# EAGLE design AnalogOutputModule_4ch_r3 (EAGLE 7.7.0)
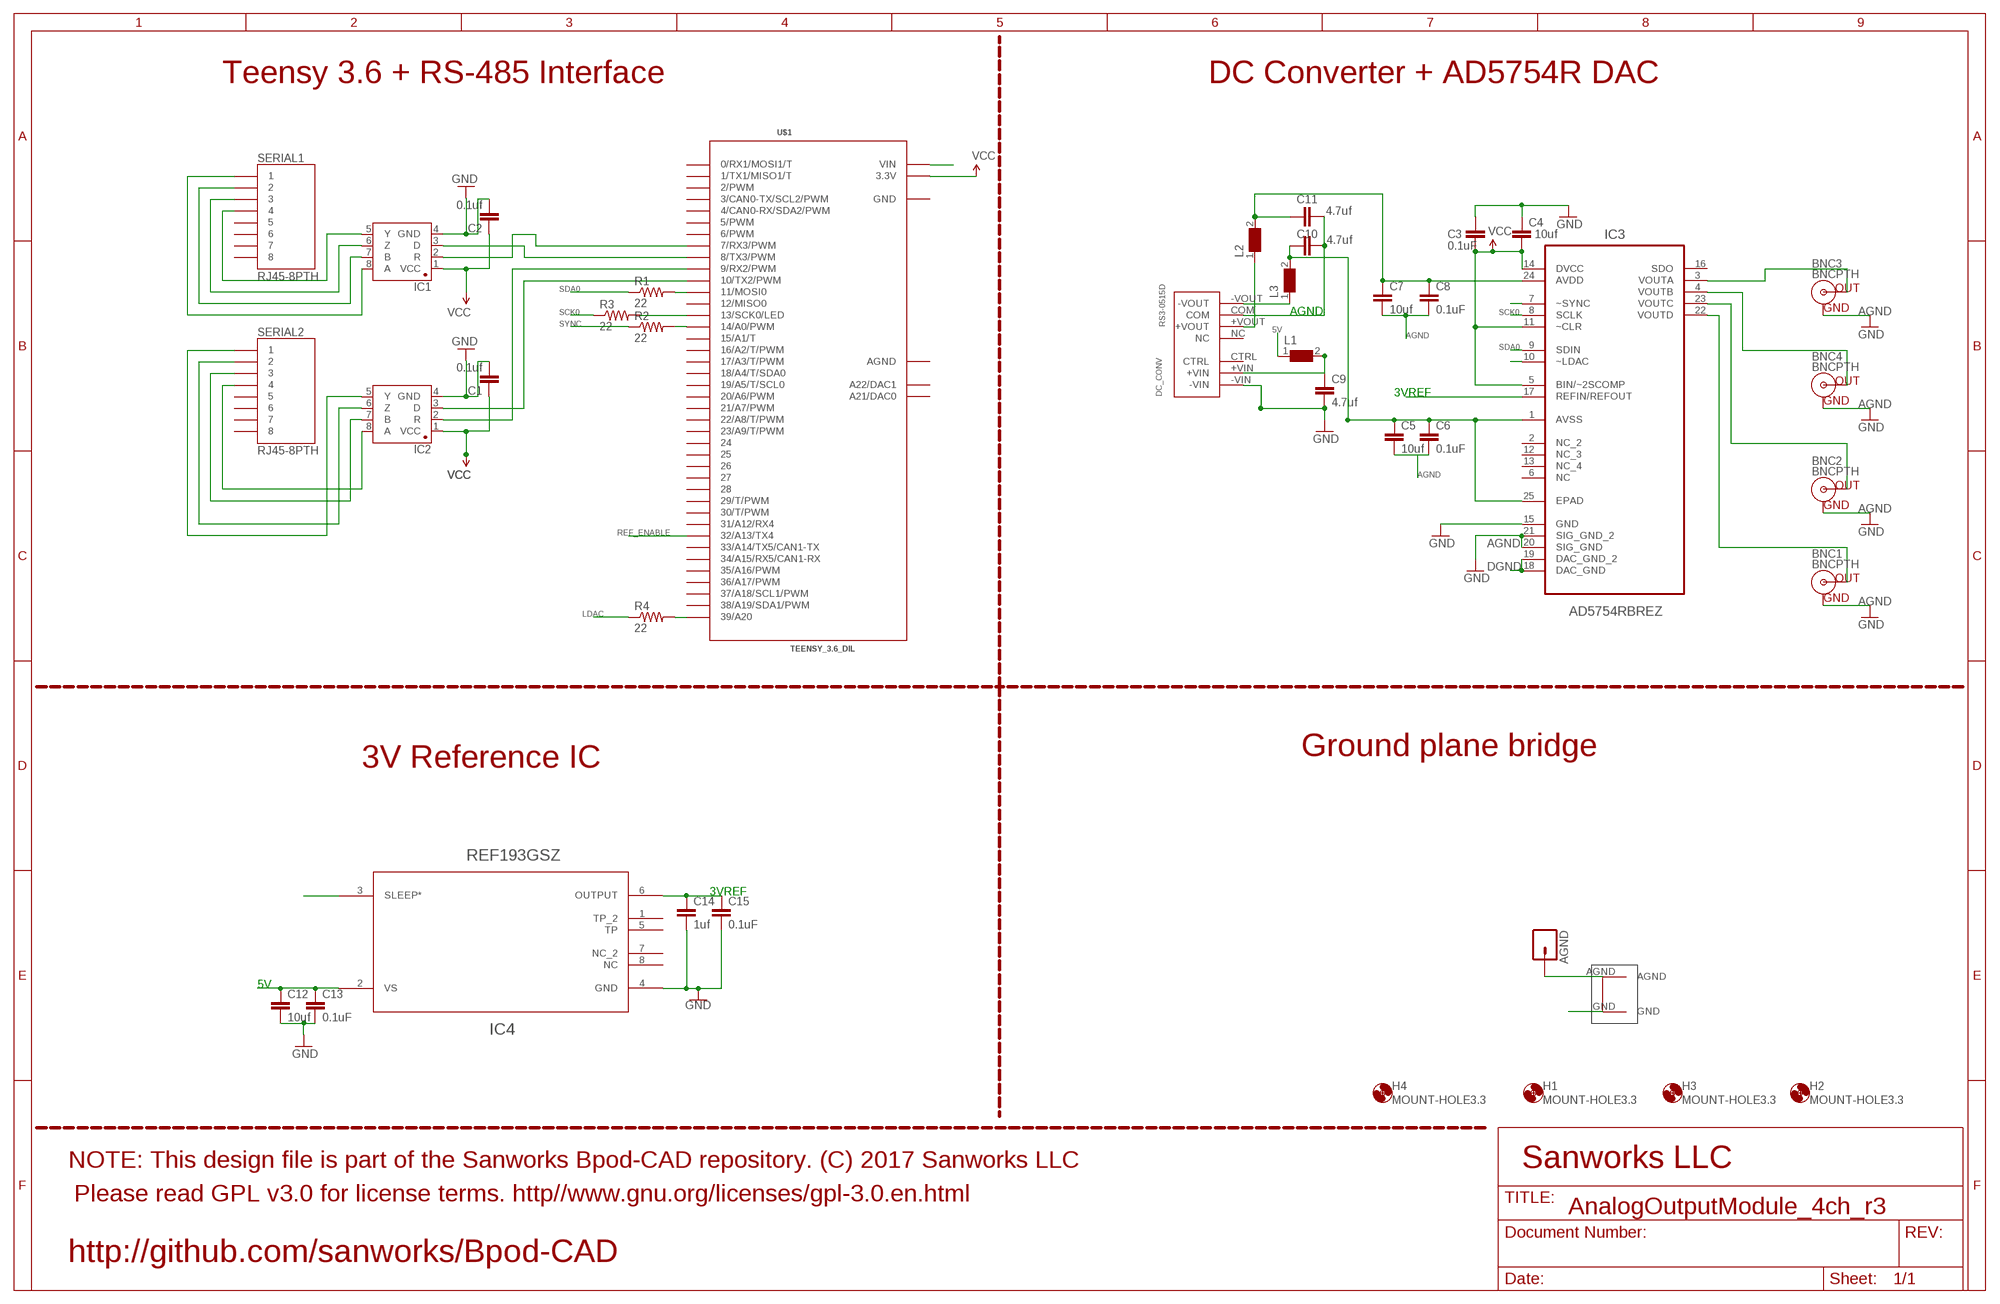
[diagram p0: schematic, sheet 1]

## Parts
AGND  M01PTH  [1X01]
BNC1  BNCPTH  [BNC]
BNC2  BNCPTH  [BNC]
BNC3  BNCPTH  [BNC]
BNC4  BNCPTH  [BNC]
C1  0.1uf  CAP1206  [1206@1]
C2  0.1uf  CAP1206  [1206@1]
C3  0.1uF  1.0UF-0805-25V-10%  [0805]
C4  10uf  CAP1206  [1206@1]
C5  10uf  CAP1206  [1206@1]
C6  0.1uF  1.0UF-0805-25V-10%  [0805]
C7  10uf  CAP1206  [1206@1]
C8  0.1uF  1.0UF-0805-25V-10%  [0805]
C9  4.7uf  CAP1206  [1206@1]
C10  4.7uf  CAP1206  [1206@1]
C11  4.7uf  CAP1206  [1206@1]
C12  10uf  CAP1206  [1206@1]
C13  0.1uF  1.0UF-0805-25V-10%  [0805]
C14  1uf  CAP1206  [1206@1]
C15  0.1uF  1.0UF-0805-25V-10%  [0805]
DC_CONV  RS3-0515D  [RS3-0515D]
H1  MOUNT-HOLE3.3  [3,3]
H2  MOUNT-HOLE3.3  [3,3]
H3  MOUNT-HOLE3.3  [3,3]
H4  MOUNT-HOLE3.3  [3,3]
IC1  SN65HVD31DR  [SO08]
IC2  SN65HVD31DR  [SO08]
IC3  AD5754RBREZ  [SOP65P640X120-25N]
IC4  REF193GSZ  [R_8]
L1  WE-CBF-742792118_1206  [1206]
L2  WE-CBF-742792118_1206  [1206]
L3  WE-CBF-742792118_1206  [1206]
R1  22  RESISTOR1206  [1206]
R2  22  RESISTOR1206  [1206]
R3  22  RESISTOR1206  [1206]
R4  22  RESISTOR1206  [1206]
SERIAL1  RJ45-8PTH  [RJ45-8]
SERIAL2  RJ45-8PTH  [RJ45-8]
U$1  TEENSY_3.6_DIL  [TEENSY_3.6_DIL]
U$6  GNDPLANESHRT  [GNDPLANESHRT]

## Nets
3VREF: C14.1 C15.1 IC3.17(REFIN/REFOUT) IC4.6(OUTPUT)
5V: C3.2 C4.2 C12.1 C13.1 IC3.5(BIN/~2SCOMP) IC3.11(~CLR) IC3.14(DVCC) IC4.2(VS) L1.1 U$1.VIN ; supply symbol labelled VCC
AGND: AGND.1 BNC1.GND BNC2.GND BNC3.GND BNC4.GND C5.2 C6.2 C7.2 C8.2 C10.1 C11.2 DC_CONV.COM IC3.18(DAC_GND) IC3.19(DAC_GND_2) IC3.20(SIG_GND) IC3.21(SIG_GND_2) U$6.AGND ; supply symbol labelled GND
GND: C1.2 C2.2 C3.1 C4.1 C9.2 C12.2 C13.2 C14.2 C15.2 DC_CONV.-VIN IC1.4(GND) IC2.4(GND) IC3.15(GND) IC4.4(GND) U$6.GND
LDAC: IC3.10(~LDAC) R4.1
N$1: IC1.3(D) U$1.8(8/TX3/PWM)
N$2: IC1.2(R) U$1.7(7/RX3/PWM)
N$3: IC2.8(A) SERIAL2.4
N$4: IC2.7(B) SERIAL2.3
N$5: IC2.6(Z) SERIAL2.2
N$6: IC2.5(Y) SERIAL2.1
N$7: IC2.3(D) U$1.10(10/TX2/PWM)
N$8: IC2.2(R) U$1.9(9/RX2/PWM)
N$9: BNC3.S(OUT) IC3.3(VOUTA)
N$10: BNC4.S(OUT) IC3.4(VOUTB)
N$11: BNC2.S(OUT) IC3.23(VOUTC)
N$12: BNC1.S(OUT) IC3.22(VOUTD)
N$13: R1.2 U$1.11(11/MOSI0)
N$14: R3.2 U$1.13(13/SCK0/LED)
N$15: DC_CONV.-VOUT L3.1
N$16: DC_CONV.+VOUT L2.1
N$17: R2.2 U$1.14/A0(14/A0/PWM)
N$18: R4.2 U$1.39/A20
N$19: IC1.8(A) SERIAL1.1
N$21: IC1.7(B) SERIAL1.2
N$22: IC1.6(Z) SERIAL1.3
N$23: IC1.5(Y) SERIAL1.4
N$39: C7.1 C8.1 C10.2 IC3.24(AVDD) L2.2
N$41: C9.1 DC_CONV.+VIN L1.2
REF_ENABLE: IC4.3(SLEEP*) U$1.32/A13(32/A13/TX4)
SCK0: IC3.8(SCLK) R3.1
SDA0: IC3.9(SDIN) R1.1
SYNC: IC3.7(~SYNC) R2.1
VCC: C1.1 C2.1 IC1.1(VCC) IC2.1(VCC) U$1.3.3V U$1.3.3V3(3.3V)
VSS: C5.1 C6.1 C11.1 IC3.1(AVSS) IC3.25(EPAD) L3.2
Unconnected: DC_CONV.CTRL DC_CONV.NC IC3.2(NC_2) IC3.6(NC) IC3.12(NC_3) IC3.13(NC_4) IC3.16(SDO) IC4.1(TP_2) IC4.5(TP) IC4.7(NC_2) IC4.8(NC) SERIAL1.5 SERIAL1.6 SERIAL1.7 SERIAL1.8 SERIAL2.5 SERIAL2.6 SERIAL2.7 SERIAL2.8 U$1.0(0/RX1/MOSI1/T) U$1.1(1/TX1/MISO1/T) U$1.2(2/PWM) U$1.3(3/CAN0-TX/SCL2/PWM) U$1.4(4/CAN0-RX/SDA2/PWM) U$1.5(5/PWM) U$1.6(6/PWM) U$1.12(12/MISO0) U$1.15/A1(15/A1/T) U$1.16/A2(16/A2/T/PWM) U$1.17/A3(17/A3/T/PWM) U$1.18/A4(18/A4/T/SDA0) U$1.19/A5(19/A5/T/SCL0) U$1.20/A6(20/A6/PWM) U$1.21/A7(21/A7/PWM) U$1.22/A8(22/A8/T/PWM) U$1.23/A9(23/A9/T/PWM) U$1.24 U$1.25 U$1.26 U$1.27 U$1.28 U$1.29(29/T/PWM) U$1.30(30/T/PWM) U$1.31/A12(31/A12/RX4) U$1.33/A14(33/A14/TX5/CAN1-TX) U$1.34/A15(34/A15/RX5/CAN1-RX) U$1.35/A16(35/A16/PWM) U$1.36/A17(36/A17/PWM) U$1.37/A18(37/A18/SCL1/PWM) U$1.38/A19(38/A19/SDA1/PWM) U$1.A21(A21/DAC0) U$1.A22(A22/DAC1)

## Notes on the sheet
- Teensy 3.6 + RS-485 Interface | DC Converter + AD5754R DAC
- SDA0
- SCK0 | AGND | SCK0 | AGND
- SYNC
- 5V
- AGND
- SDA0
- 3VREF
- AGND
- AGND
- AGND
- REF_ENABLE
- AGND
- DGND
- AGND
- LDAC
- Ground plane bridge
- 3V Reference IC
- 3VREF
- 5V
- NOTE: This design file is part of the Sanworks Bpod-CAD repository. (C) 2017 Sanworks LLC | Sanworks LLC
- Please read GPL v3.0 for license terms. http//www.gnu.org/licenses/gpl-3.0.en.html
- http://github.com/sanworks/Bpod-CAD

## Power pins joined to a net without a drawn wire
AGND: U$1.AGND
GND: U$1.GND U$1.GND1(GND)

## Library data of the parts
AGND = SparkFun-Connectors:M01: Header 1 Standard 1-pin 0.1" header. Use with straight break away headers (SKU : PRT-00116), right angle break away headers (PRT-00553), swiss pins (PRT-00743), machine pins (PRT-00117), and female headers (PRT-00115).
BNC1-BNC4 = SparkFun-Connectors:BNC: BNC Right Angle Connector Mouser Part# 5227161 SparkFun Products: BNC Connector - Right Angle <https://www.sparkfun.com/products/10550>; PROD_ID: LPA-12729; SF_ID: PRT-10550
C1 C2 C4 C5 C7 C9-C12 C14 = SparkFun-Capacitors:CAP: Capacitor Standard 0603 ceramic capacitor, and 0.1" leaded capacitor.
C3 C6 C8 C13 C15 = SparkFun-Capacitors:1.0UF: 1µF ceramic capacitors A capacitor is a passive two-terminal electrical component used to store electrical energy temporarily in an electric field.; PROD_ID: CAP-08064; VALUE: 1.0uF
DC_CONV = JoshParts10:RS3-0515D
H1-H4 = holes:MOUNT-HOLE: MOUNTING HOLE with drill center marker
IC1 IC2 = Joshparts4:SN65HVD31DR: A placeholder for generic narrow & wide SOIC8 foorptints - used on the DIP adapter board.
IC3 = Analog Devices_By_element14_Batch_1:AD5754RBREZ: DAC; MPN: AD5754RBREZ; OC_FARNELL: 1786050; OC_NEWARK: 51P3755; PACKAGE: TSSOP-24; SUPPLIER: Analog Devices
IC4 = REF193:REF193GSZ; MANUFACTURER_PART_NUMBER: REF193GSZ; VENDOR: Vendor
L1-L3 = WE-CBF:WE-CBF: SMD EMI Suppression Ferrite Beads WE-CBF - Excellent anti-EMI properties - Low DC-restistance - Impedances till 3000 ohms - Rated current up to 6 A -- Reliable Ni-Sn electrodes -- Perfect as data lined filter and for uncoupling of distribution voltage; MPN: 742792118; OC_FARNELL: 1800374; OC_NEWARK: 78R5648; PACKAGE: IND-1206; SUPPLIER: Wuerth Elektronik
R1-R4 = SparkFun-Resistors:RESISTOR: Resistor Basic schematic elements and footprints for 0603, 1206, and PTH resistors.
SERIAL1 SERIAL2 = SparkFun:RJ45-8: RJ45 Jack Simple RJ45, 8-pin connection - connector for common Cat5, Cat5e, and Cat6 Ethernet cables. Footprint not yet proven in production. Connector sku is PRT-00643; Breakout PCB sku is BOB-00716.
U$1 = Teensy_3_and_LC_Series_Boards_v1.4:TEENSY_3.6_DIL: Teensy 3.6 DIL Package
U$6 = Joshparts2:GNDPLANESHRT

## Net classes
0 default: width 0.203 mm

## Board
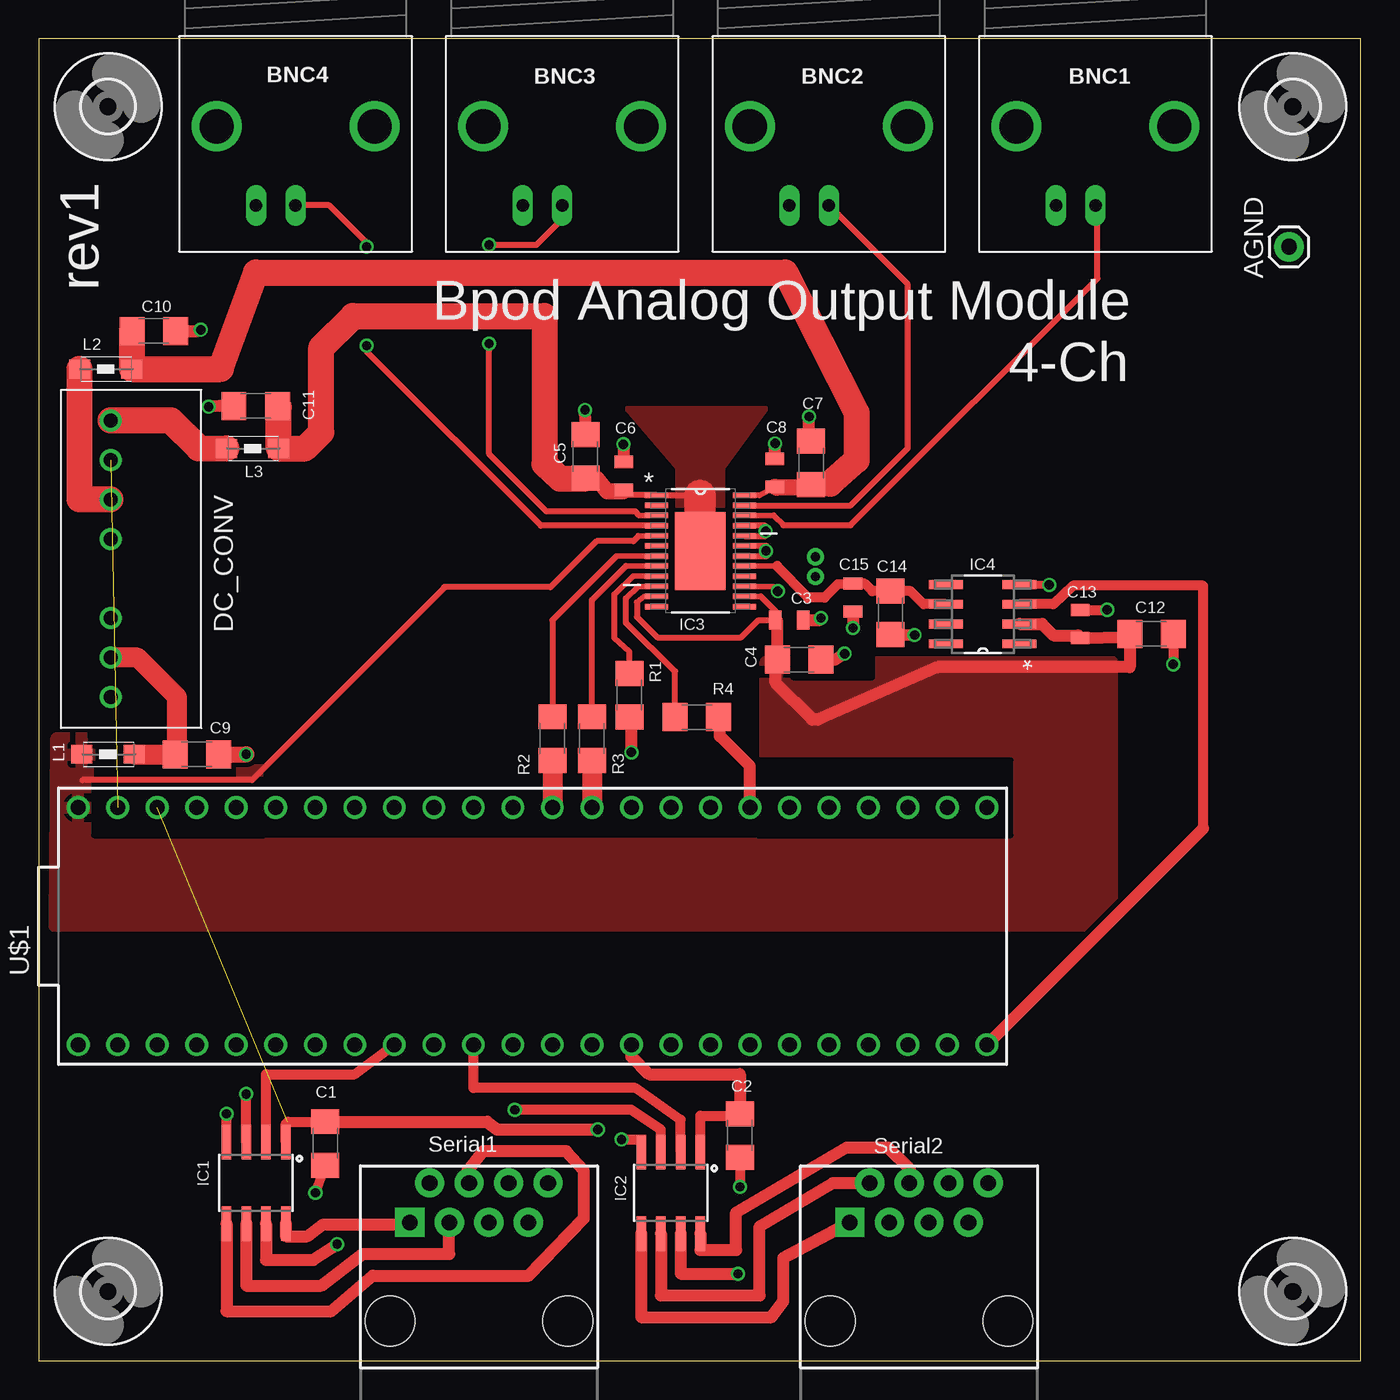
[diagram p1: board, top side]
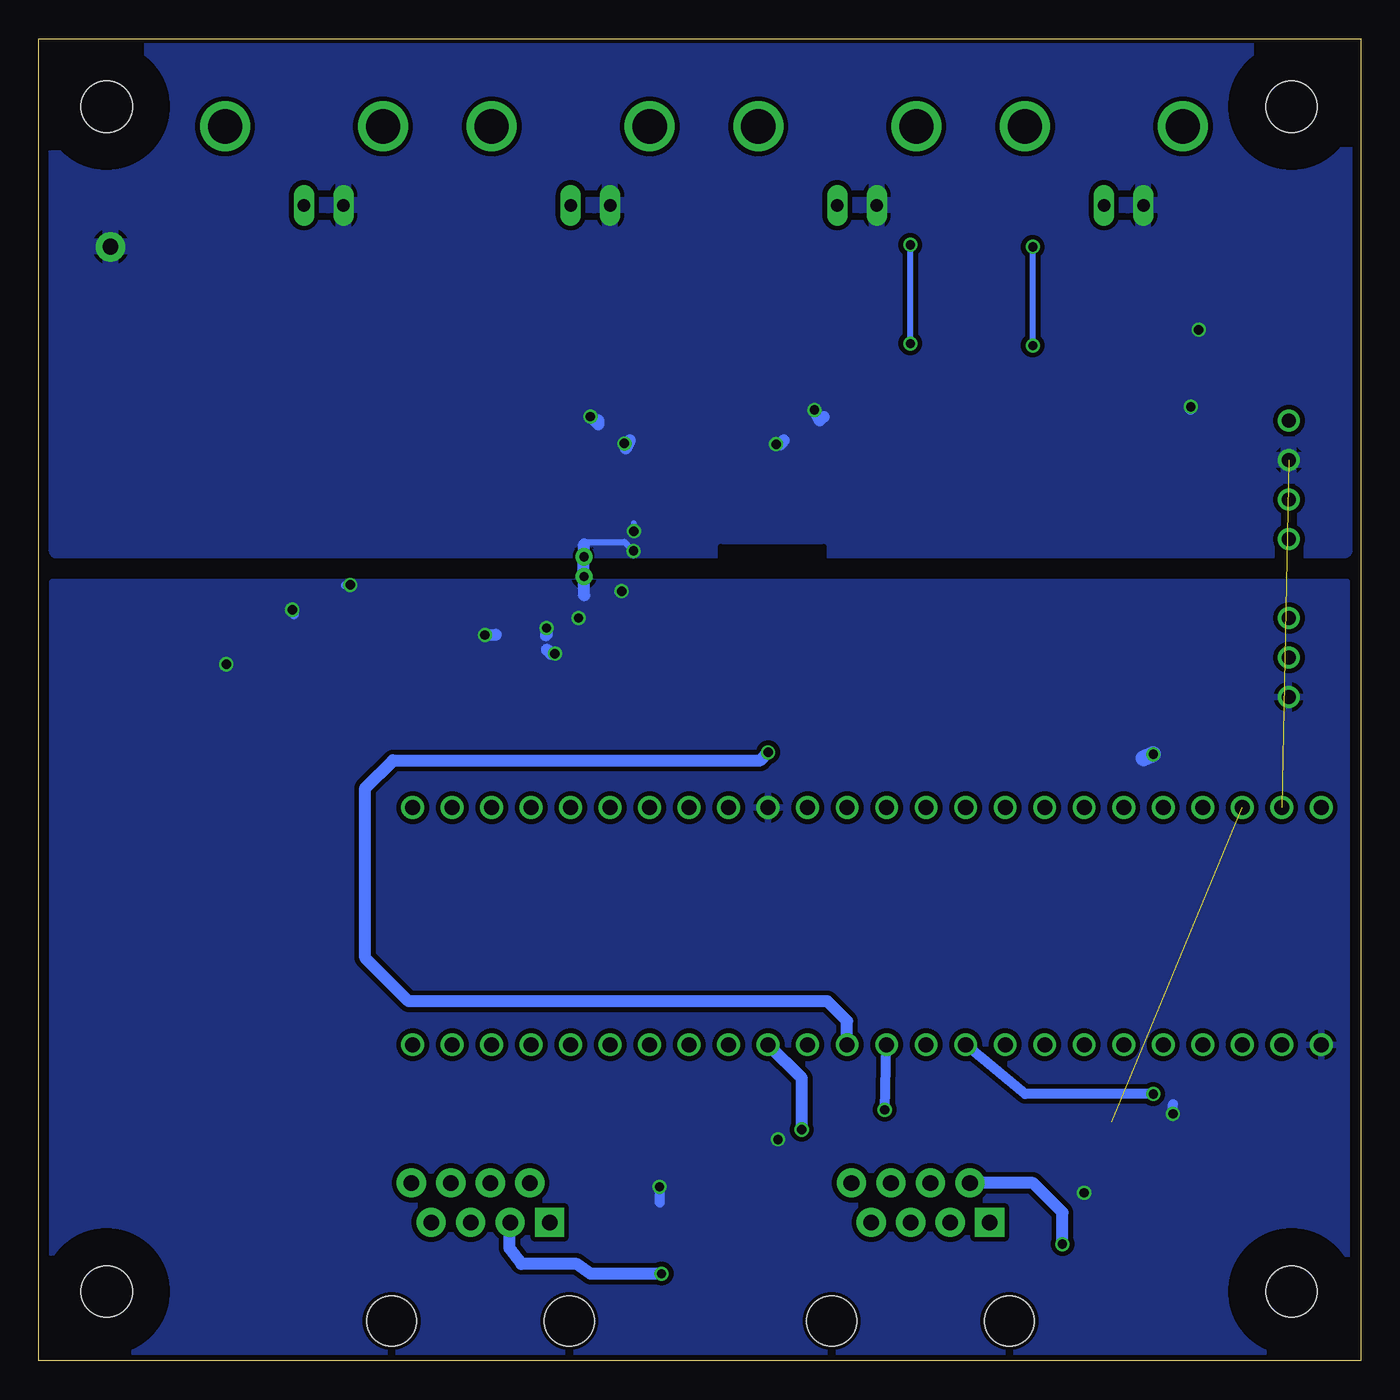
[diagram p2: board, bottom side, seen from below]

Size 85 x 85 mm. Coordinates in mm from the lower left corner, seen from the top.
Outline: 0,0 85,0 85,85 0,85 0,0
Copper layers (1*16): Top 0.035mm / dielectric 1.5mm / Bottom 0.035mm
Design rules "SeeedStudio_2layer_DRU_no_angle_20140221 *": minimum track width 6mil, minimum drill 12mil, track to track 12mil, track to pad 12mil, pad to pad 12mil, via to via 12mil, smd to smd 0mil, copper to edge 10mil, drill to drill 10mil, minimum pad ring 10mil, minimum via ring 6mil, stop-mask expansion 2mil, vias tented up to drill 100mil, thermal gap 10mil
tRestrict: area 46.2,33.8 to 62.5,38.6; area 3.8,37.6 to 11.4,40.6; area 3.6,33.8 to 14.5,37.3; area 48.5,43.9 to 53.6,46
bRestrict: area 34.5,50.8 to 41.1,52.3

### Footprints (pad centres in the part's own frame; a part is rotated, then mirrored left to right if it is on the bottom)
1X01 = drill 1.016 pad 1.88: 1 0,0
BNC = drill 2.2: 3 -5.08,5.08; 4 5.08,5.08 | drill 0.8 long: GND -2.54,0; S 0,0
1206@1 = smd 1.6 x 1.8: 1 -1.4,0; 2 1.4,0
0805 = smd 0.8 x 1.2: 1 -0.9,0; 2 0.9,0
RS3-0515D = drill 0.9: +VIN 7.62,5.08; +VOUT 17.78,5.08; -VIN 5.08,5.08; -VOUT 22.86,5.08; COM 20.32,5.08; CTRL 10.16,5.08; NC 15.24,5.08
3,3 = hole 3.3: 0,0
SO08 = smd 0.61 x 2.21: 1 -1.905,-2.616; 2 -0.635,-2.616; 3 0.635,-2.616; 4 1.905,-2.616; 5 1.905,2.616; 6 0.635,2.616; 7 -0.635,2.616; 8 -1.905,2.616
SOP65P640X120-25N = smd 1.473 x 0.356: 1 -2.819,3.581; 2 -2.819,2.921; 3 -2.819,2.286; 4 -2.819,1.626; 5 -2.819,0.965; 6 -2.819,0.33; 7 -2.819,-0.33; 8 -2.819,-0.965; 9 -2.819,-1.626; 10 -2.819,-2.286; 11 -2.819,-2.921; 12 -2.819,-3.581; 13 2.819,-3.581; 14 2.819,-2.921; 15 2.819,-2.286; 16 2.819,-1.626; 17 2.819,-0.965; 18 2.819,-0.33; 19 2.819,0.33; 20 2.819,0.965; 21 2.819,1.626; 22 2.819,2.286; 23 2.819,2.921; 24 2.819,3.581 | smd 3.251 x 5.029: 25 0,0
R_8 = smd 2.184 x 0.559: 1 -2.362,1.905; 2 -2.362,0.635; 3 -2.362,-0.635; 4 -2.362,-1.905; 5 2.362,-1.905; 6 2.362,-0.635; 7 2.362,0.635; 8 2.362,1.905
1206 = smd 1.35 x 1.2: 1 -1.675,0; 2 1.675,0
1206' = smd 1.6 x 1.8: 1 -1.4,0; 2 1.4,0
RJ45-8 = drill 1 pad 1.88 square: 1 -4.445,6.35 | drill 1 pad 1.88: 2 -3.175,8.89; 3 -1.905,6.35; 4 -0.635,8.89; 5 0.635,6.35; 6 1.905,8.89; 7 3.175,6.35; 8 4.445,8.89 | hole 3.2: -5.715,0; 5.715,0
TEENSY_3.6_DIL = drill 0.965: 0 -7.62,25.4; 1 -7.62,22.86; 2 -7.62,20.32; 3 -7.62,17.78; 3.3V 7.62,22.86; 3.3V3 -7.62,-7.62; 4 -7.62,15.24; 5 -7.62,12.7; 6 -7.62,10.16; 7 -7.62,7.62; 8 -7.62,5.08; 9 -7.62,2.54; 10 -7.62,0; 11 -7.62,-2.54; 12 -7.62,-5.08; 13 7.62,-5.08; 14/A0 7.62,-2.54; 15/A1 7.62,0; 16/A2 7.62,2.54; 17/A3 7.62,5.08; 18/A4 7.62,7.62; 19/A5 7.62,10.16; 20/A6 7.62,12.7; 21/A7 7.62,15.24; 22/A8 7.62,17.78; 23/A9 7.62,20.32; 24 -7.62,-10.16; 25 -7.62,-12.7; 26 -7.62,-15.24; 27 -7.62,-17.78; 28 -7.62,-20.32; 29 -7.62,-22.86; 30 -7.62,-25.4; 31/A12 -7.62,-27.94; 32/A13 -7.62,-30.48; 33/A14 7.62,-30.48; 34/A15 7.62,-27.94; 35/A16 7.62,-25.4; 36/A17 7.62,-22.86; 37/A18 7.62,-20.32; 38/A19 7.62,-17.78; 39/A20 7.62,-15.24; A21 7.62,-12.7; A22 7.62,-10.16; AGND 7.62,25.4; GND -7.62,27.94; GND1 7.62,-7.62; VIN 7.62,27.94
GNDPLANESHRT = drill 0.6: AGND -1.27,0; GND 0,0

### Placement (x,y rotation side)
AGND  80.39,71.63 0 top
BNC1  67.94,74.3 0 top
BNC2  50.8,74.3 0 top
BNC3  33.66,74.3 0 top
BNC4  16.51,74.3 0 top
C1  18.41,13.97 270 top
C2  45.09,14.48 270 top
C3  48.26,47.62 180 top
C4  48.9,45.09 180 top
C5  35.15,58.15 90 top
C6  37.62,56.91 90 top
C7  49.66,57.73 90 top
C8  47.33,57.09 90 top
C9  10.16,38.99 0 top
C10  7.4,66.22 180 top
C11  13.94,61.39 180 top
C12  71.55,46.74 0 top
C13  66.95,47.37 90 top
C14  54.76,48.08 270 top
C15  52.35,49.07 270 top
DC_CONV  9.69,37.59 90 top
H1  80.64,4.45 0 top
H2  4.45,4.45 0 top
H3  4.45,80.64 0 top
H4  80.64,80.64 0 top
IC1  13.97,11.43 180 top
IC2  40.64,10.79 180 top
IC3  42.55,52.07 0 top
IC4  60.71,48.01 180 top
L1  4.45,38.99 0 top
L2  4.29,63.77 0 top
L3  13.74,58.65 0 top
R1  22  [1206']  37.97,42.8 270 top
R2  22  [1206']  33.02,40.01 270 top
R3  22  [1206']  35.56,40.01 270 top
R4  22  [1206']  42.32,41.38 0 top
SERIAL1  28.3,2.54 0 top
SERIAL2  56.6,2.54 0 top
U$1  30.48,27.94 90 top
U$6  49.94,50.42 270 top

### Tracks (layer width: path | path; a pad name or v marks a point on that pad's centre or on a via)
3VREF
  Top 0.356: 47.47,51.1 IC3.17
  Top 0.635: IC4.6 56.9,48.64 56.06,49.48 C14.1 53.59,49.48 53.11,49.96 52.39,49.96 C15.1 51.37,49.92 50.52,49.07 49.45,49.07 47.47,51.1
5V
  Top 0.356: 46.43,49.15 IC3.14 | IC3.11 38.91,49.15 38.46,48.77 | IC3.5 38.56,53.03
  Top 0.381: 47.16,47.37 C3.2 | 46.43,49.15 47.4,48.18 47.4,47.64 C3.2 | 38.46,48.77 38.46,47.83 39.78,46.51 45.16,46.51 46.28,47.62 C3.2 | 47.47,46.51 47.49,46.53 | 2.79,37.34 13.72,37.34 26.04,49.66 26.04,49.73 32.89,49.73 35.87,52.7 38.23,52.7 38.56,53.03
  Top 0.635: 63.08,47.38 IC4.2
  Top 0.762: C3.2 47.49,47.54 47.49,46.53 C4.2 47.37,44.96 47.37,43.59 49.73,41.22 50.09,41.22 57.78,44.6 70.16,44.6 70.15,44.6 C12.1 69.94,46.52 C13.1 66.84,46.63 65.25,46.63 64.5,47.38 63.08,47.38
  pour Top: 1.12,40.03 14.07,40.03 13.97,33.27 46.74,33.27 46.74,44.96 69.01,44.93 69.01,27.91 1.02,27.94
AGND  (via drill 0.6)  (1 unrouted)
  Top 0.381: v46.74,53.34 46.74,53.03 IC3.20 46.71,53.03 46.71,53.7 IC3.21 | IC3.19 46.76,52.4 v46.76,52.07 46.76,51.74 IC3.18
  Top 0.762: C5.2 35.15,60.36 v35.13,61.14 | C6.2 37.62,58.9 v37.59,58.93 | C8.2 47.35,58.83 v47.35,58.98 | C7.2 49.53,59.05 v49.53,60.71 | C10.1 10.16,66.22 v10.41,66.29 | C11.2 11.61,61.39 v10.92,61.34
  Bottom 0.381: v46.74,53.34 46.74,53.85 | 46.79,51.77 46.79,52.07 v46.76,52.07 47.35,52.65 49.78,52.65 49.94,52.5
  Bottom 0.762: v35.13,61.14 34.8,60.45 34.54,60.71 | v37.59,58.93 37.34,58.93 37.08,59.18 | v47.35,58.98 47.24,58.67 46.99,59.18 | v49.53,60.71 49.02,60.2 49.02,60.45 | v10.92,61.34 10.92,61.21 | U$6.AGND 49.94,52.5
  pour Bottom: 1.04,84.48 1.04,52.1 83.85,52.07 83.85,84.45
GND  (via drill 0.6)
  Top 0.356: IC3.15 47.22,49.78 v47.52,49.48
  Top 0.508: IC4.4 64.95,49.91 v64.97,49.89
  Top 0.635: C1.2 v17.78,10.79 | IC1.4 v12.06,15.88 | C2.2 v45.09,11.18 | v37.47,14.22 38.73,14.22 IC2.4 | C12.2 v72.95,44.78 | C13.2 v68.71,48.28
  Top 0.762: C3.1 50.16,47.62 v50.29,47.75 | C4.1 51.18,45.09 v51.82,45.47 | C14.2 55.04,46.68 v56.31,46.66 | C15.2 v52.35,47.12
  Top 1.016: C9.2 v13.34,38.99
  Bottom 0.381: v47.52,49.48 47.8,49.48 47.83,49.45
  Bottom 0.508: v64.97,49.89 65.3,49.89 65.33,49.86
  Bottom 0.635: v12.06,15.88 12.06,16.51 | v45.09,11.18 45.09,10.16 | v72.95,44.78 72.87,44.83 | v68.71,48.28 68.61,48.01
  Bottom 0.762: v51.82,45.47 52.07,45.47 52.32,45.72 | 49.96,51.77 49.96,50.11 49.96,49.25 49.94,49.23 U$6.GND | v56.31,46.66 55.63,46.69 | v52.35,47.12 52.35,46.71 52.4,46.66
  Bottom 1.016: v13.34,38.99 13.97,38.73
  pour Bottom: 0.89,50.09 0.89,0.56 84.15,0.53 84.15,50.06
LDAC
  Top 0.356: 38.56,49.78 IC3.10
  Top 0.381: R4.1 40.92,44.33 37.74,47.45 37.74,49.02 38.56,49.78
N$1  (via drill 0.6)
  Top 0.635: IC1.3 v13.34,17.14
  Bottom 0.635: v13.34,17.14 21.59,17.14 U$1.8
N$2
  Top 0.635: IC1.2 14.61,18.41 20.32,18.41 U$1.7
N$3
  Top 0.762: SERIAL2.4 56.01,11.47 56.01,12.32 54.61,13.72 51.94,13.72 44.83,9.53 44.83,7.11 42.55,7.11 IC2.8
N$4  (via drill 0.6)
  Top 0.762: IC2.7 41.27,5.59 v44.96,5.59
  Bottom 0.762: v44.96,5.59 49.53,5.59 50.42,6.22 53.98,6.22 54.74,7.24 54.74,8.85 SERIAL2.3
N$5
  Top 0.762: IC2.6 40.01,4.19 46.35,4.19 46.35,8.64 51.05,11.43 SERIAL2.2
N$6
  Top 0.762: IC2.5 38.73,2.79 47.12,2.79 47.88,3.81 47.88,6.6 SERIAL2.1 52.07,8.8
N$7  (via drill 0.6)
  Top 0.635: IC2.3 40.01,14.86 38.1,16.13 v30.61,16.13
  Bottom 0.635: v30.61,16.13 U$1.10
N$8
  Top 0.635: IC2.2 41.27,15.49 38.35,17.53 27.94,17.53 U$1.9
N$9  (via drill 0.6)
  Top 0.356: IC3.3 38.61,54.36
  Top 0.381: v28.96,71.75 32,71.75 33.66,73.41 BNC3.S | v28.96,65.41 28.96,58.29 32.64,54.61 38.35,54.61 38.61,54.36
  Bottom 0.381: v28.96,65.41 v28.96,71.75
N$10  (via drill 0.6)
  Top 0.381: IC3.4 32.28,53.7 21.08,64.9 v21.08,65.28 | v21.08,71.63 21.08,71.88 18.67,74.3 BNC4.S
  Bottom 0.381: v21.08,65.28 v21.08,71.63
N$11
  Top 0.381: IC3.23 52.2,54.99 55.88,58.67 55.88,69.22 BNC2.S
N$12
  Top 0.356: IC3.22 47.24,54.36
  Top 0.381: BNC1.S 68.07,74.17 68.07,69.6 52.2,53.72 47.88,53.72 47.24,54.36
N$13  (via drill 0.6)
  Top 0.762: v38.1,39.12 38.1,41.27 R1.2
  Bottom 0.762: U$1.11 33.02,21.84 34.29,23.11 61.21,23.11 64.01,25.91 64.01,36.83 62.23,38.61 38.61,38.61 v38.1,39.12
N$14
  Top 1.27: R3.2 U$1.13
N$15
  Top 1.676: L3.1 10.27,58.68 8.49,60.45 DC_CONV.-VOUT
N$16
  Top 1.676: DC_CONV.+VOUT 2.61,55.38 L2.1
N$17
  Top 1.27: R2.2 U$1.14/A0
N$18
  Top 0.762: U$1.39/A20 45.72,38.23 43.79,40.16 43.79,41.3 R4.2
N$19
  Top 0.762: IC1.8 15.88,8 17.27,8 18.29,8.76 23.73,8.76 SERIAL1.1
N$21  (via drill 0.6)
  Top 0.762: IC1.7 14.61,6.48 17.65,6.48 v19.18,7.49
  Bottom 0.762: v19.18,7.49 19.18,9.53 21.08,11.43 SERIAL1.2
N$22
  Top 0.762: IC1.6 13.34,4.83 18.16,4.83 20.83,6.86 26.39,6.86 SERIAL1.3
N$23
  Top 0.762: IC1.5 12.06,3.17 18.8,3.17 21.46,5.46 31.5,5.46 35.05,9.14 35.05,12.19 33.91,13.46 28.57,13.46 27.56,12.19 27.56,11.54 SERIAL1.4 27.69,11.45
N$39
  Top 0.356: IC3.24 46.33,55.65
  Top 0.381: 46.33,55.65 C8.1
  Top 1.016: C7.1 49.7,56.33 49.35,56.13 47.46,56.13 C8.1
  Top 1.27: L2.2 6,63.77 | 50.88,56.39 49.78,56.19 C7.1
  Top 1.676: C10.2 6,63.77 11.7,63.77 13.97,69.98 48.01,69.98 52.58,60.96 52.58,57.91 50.88,56.39
N$41
  Top 1.27: C9.1 L1.2 C9.1 8.89,38.86 8.89,42.67 6.35,45.21 DC_CONV.+VIN
REF_ENABLE
  Top 0.635: 74.88,34.24 74.88,49.84 66.5,49.84 65.23,48.64 IC4.3
  Top 0.762: U$1.32/A13 74.88,34.24
SCK0
  Top 0.356: 37.74,51.1 IC3.8
  Top 0.381: R3.1 35.56,48.92 37.74,51.1
SDA0
  Top 0.356: 38.23,50.44 IC3.9
  Top 0.381: R1.1 37.97,45.59 37.01,46.48 37.01,49.28 38.23,50.44
SYNC
  Top 0.356: IC3.7 37.13,51.74
  Top 0.381: 37.13,51.74 33.02,47.62 R2.1
VCC  (via drill 0.6)  (1 unrouted)
  Top 0.635: IC2.1 42.55,15.75 44.96,15.75 C2.1 | IC1.1 15.88,15.24 16,15.37 C1.1
  Top 0.762: C2.1 45.09,18.41 39.24,18.41 38.1,19.56 U$1.3.3V3 | C1.1 28.83,15.37 29.46,14.86 v35.94,14.86
  Bottom 0.762: v35.94,14.86 35.94,18.16 U$1.3.3V3
VSS
  Top 0.381: C6.1 36.58,55.65 IC3.1 42.39,55.65 42.52,55.63 | IC3.25 42.55,51.23 42.72,51.05 42.72,51.89 IC3.25 | 42.52,52.2 IC3.25
  Top 0.762: 37.57,55.91 C6.1
  Top 1.016: C5.1 35.86,56.75 36.55,55.91 37.57,55.91
  Top 1.27: 35.04,56.72 C5.1 | 15.42,61.32 C11.1
  Top 1.676: 35.04,56.72 33.53,56.72 32.51,57.66 32.51,67.18 20.19,67.18 18.16,65.15 18.16,59.69 17.12,58.65 L3.2 15.42,61.32
  Top 2.032: 42.52,55.63 42.52,52.2
  pour Top: 41.15,54.36 41.15,57.4 37.85,61.21 46.74,61.21 43.94,57.4 43.94,54.36

### Text on the board
tPlace: rev1 | Bpod Analog Output Module | 4-Ch | IC4 | Serial1 | Serial2